# Altium schematic sheet USB_TYPE_C.SchDoc
size A4; SheetNumber: 9; SheetTotal: 9
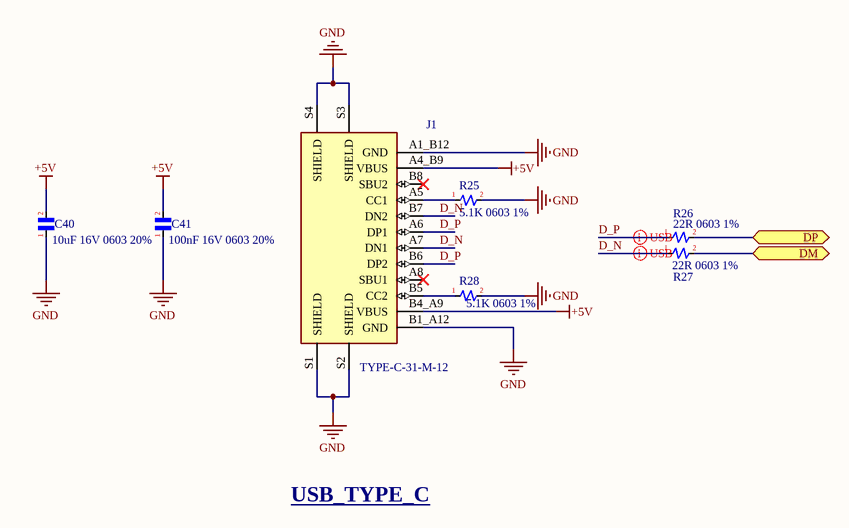
[diagram p0: USB_TYPE_C.SchDoc]

## Parts
C40  10uF 16V 0603 20%  [C_0603]
C41  100nF 16V 0603 20%  [C_0603]
J1  TYPE-C-31-M-12  [HRO_TYPE-C-31-M-12]
R25  5.1K 0603 1%  [R_0603]
R26  22R 0603 1%  [R_0603]
R27  22R 0603 1%  [R_0603]
R28  5.1K 0603 1%  [R_0603]

## Ports
DM (bidir, see TurboSpin[2B]), DP (bidir, see TurboSpin[2B])

## Nets
+5V: C40.2 C41.2 J1.A4_B9(VBUS) J1.B4_A9(VBUS)
GND: C40.1 C41.1 J1.A1_B12(GND) J1.B1_A12(GND) J1.S1(SHIELD) J1.S2(SHIELD) J1.S3(SHIELD) J1.S4(SHIELD) R25.2 R28.2
D_N: J1.A7(DN1) J1.B7(DN2) R27.1
D_P: J1.A6(DP1) J1.B6(DP2) R26.1
DM: R27.2 ; port DM
DP: R26.2 ; port DP
NetJ1_A5: J1.A5(CC1) R25.1
NetJ1_B5: J1.B5(CC2) R28.1

Not connected (* = marked no-connect by the designer): J1 A8(SBU1)* B8(SBU2)*

## Layout directives
differential pair: D_N, D_P

## Notes on the sheet
- USB_TYPE_C

## Library data of the parts
C40 C41 = Capacitor>> Non-Polar: CAP  0603 20%
J1 = TYPE-C-31-M-12: USB Connectors 24 Receptacle 1 8.94*7.3mm RoHS; MF: HRO Electronics Co., Ltd.; SnapEDA_Link: https://www.snapeda.com/parts/TYPE-C-31-M-12/HRO+Electronics+Co.%252C+Ltd./view-part/?ref=snap; Package: Package; Value: *; MP: TYPE-C-31-M-12; Check_prices: https://www.snapeda.com/parts/TYPE-C-31-M-12/HRO+Electronics+Co.%252C+Ltd./view-part/?ref=eda
R25-R28 = Resistor>> General Purpose: RES 0603 20%